# EasyEDA Pro project ProPrj_ExtModule-001_2024-08-27.epro

# Schematic ExtModule-001
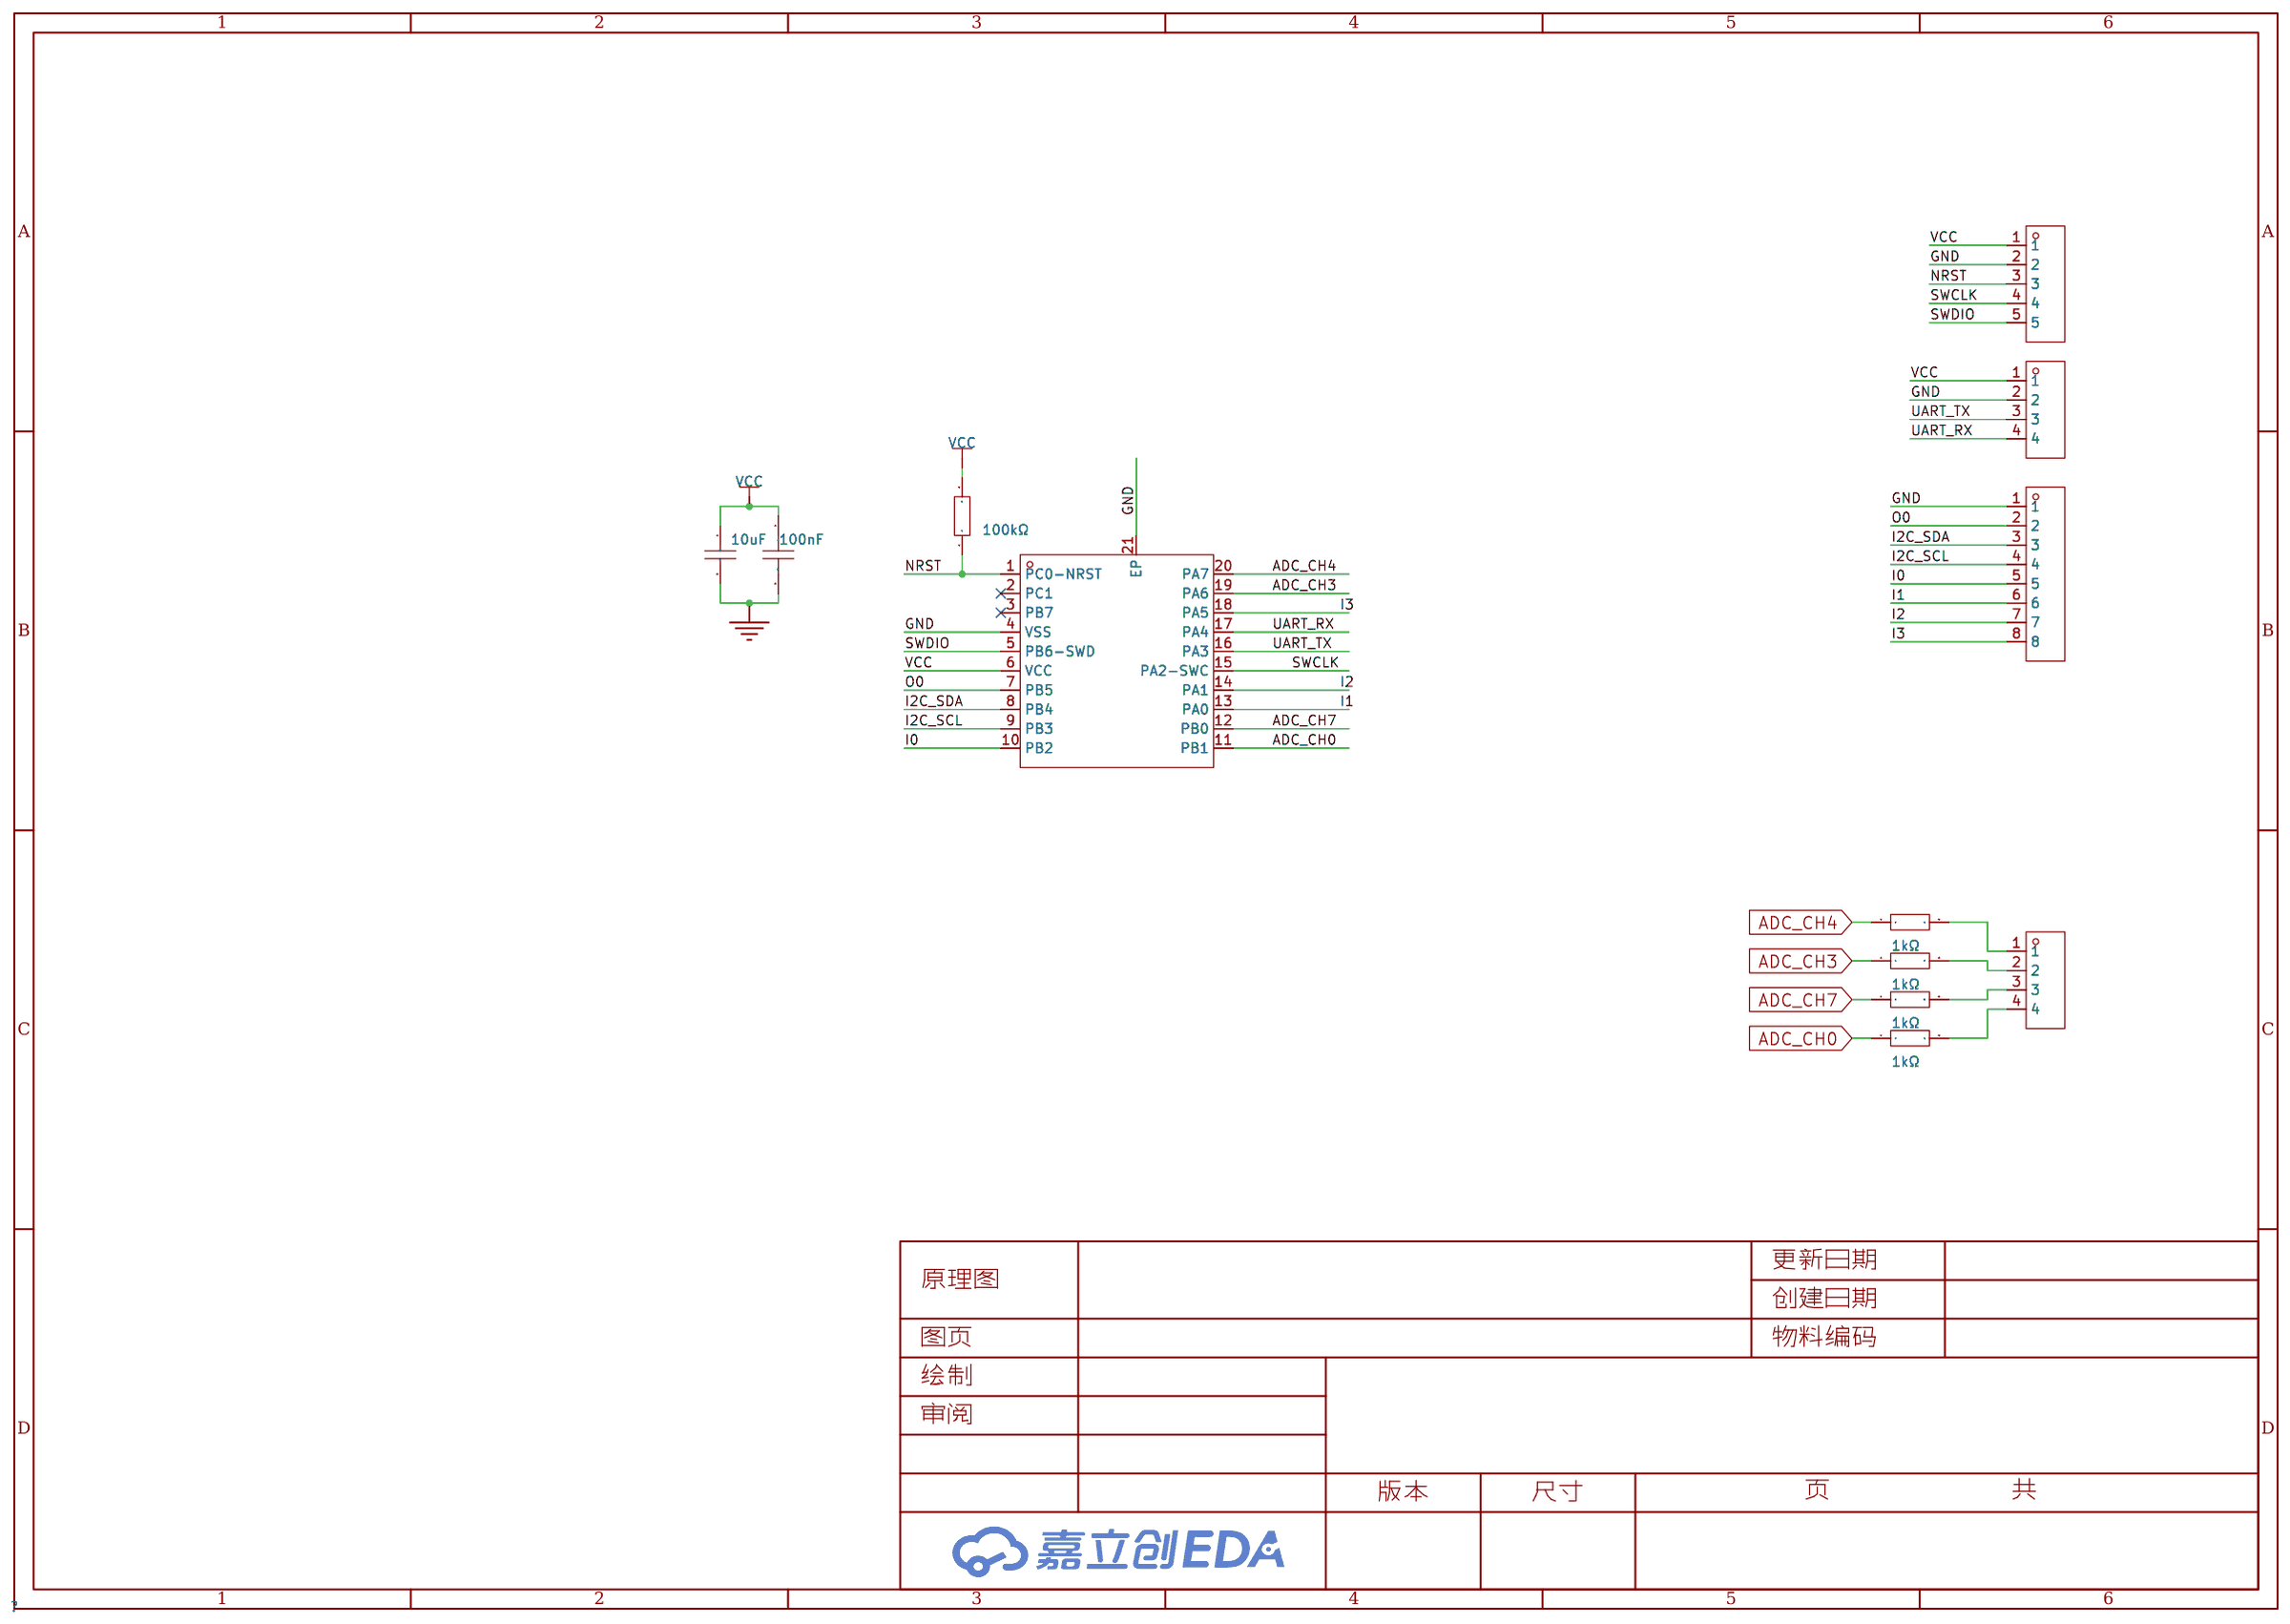
[diagram p0: schematic sheet]

## Parts
C3  100nF  [C0402]
C4  10uF  [C0402]
CN1  HC-PZ254-11.5L-1x5PZ  [HDR-TH_5P-P2.54-V-M]  (no BOM)
H1  PZ254V-11-04P  [HDR-TH_4P-P2.54-V-M]  (no BOM)
H2  PZ254V-11-08P  [HDR-TH_8P-P2.54-V-M]  (no BOM)
H3  PZ254V-11-04P  [HDR-TH_4P-P2.54-V-M]  (no BOM)
R1  100kΩ  [R0402]
R2  1kΩ  [R0402]
R3  1kΩ  [R0402]
R4  1kΩ  [R0402]
R5  1kΩ  [R0402]
U1  2dbf3a06cba34a84b0df513ae8ead8ff  [QFN-20_L3.0-W3.0-P0.40-TL-EP1.7]

## Library data of the parts
C3 = CC0402KRX7R7BB104: 容值:100nF;精度:±10%;额定电压:16V;材质(温度系数):X7R;; LCSC Part Name: 100nF ±10% 16V; Supplier Part: C60474; Manufacturer: YAGEO(国巨); Supplier Footprint: 0402; JLCPCB Part Class: Extended Part; Datasheet: https://atta.szlcsc.com/upload/public/pdf/source/20211223/9278FD768280B81DDBEF48FA36411A03.pdf; Supplier: LCSC; Tolerance: ±10%; Voltage Rated: 16V; Temperature Coefficient: X7R
C4 = CL05A106MQ5NUNC: 容值:10uF;精度:±20%;额定电压:6.3V;材质(温度系数):X5R;; LCSC Part Name: 10uF ±20% 6.3V; Supplier Part: C15525; Manufacturer: SAMSUNG(三星); Supplier Footprint: 0402; JLCPCB Part Class: 基础库; Datasheet: https://atta.szlcsc.com/upload/public/pdf/source/20220823/2B02EE04F8F211D38A52DCB16EB6BEBA.pdf; Supplier: LCSC; Tolerance: ±20%; Voltage Rated: 6.3V; Temperature Coefficient: X5R
CN1 = HC-PZ254-11.5L-1x5PZ: 插针结构：1x5P间距：2.54mm行距：-圆针/方针:方针安装类型:直插排数:单排总PIN位数:5P额定电流:3A额定电压:1000V配合针长度:6mm塑高:2.5mm端接针长度:3mm触头材质:黄铜触头镀层:金工作温度范围:-40℃~+105℃焊接温度(最大值):260℃@5s颜色:黑色; LCSC Part Name: 间距2.54mm 1x5Pin 直插 H2.5 L11.5; Supplier Part: C27985190; Manufacturer: HC(虹成电子); Supplier Footprint: 插件,P=2.54mm; Datasheet: https://atta.szlcsc.com/upload/public/pdf/source/20240710/9646E7AD10E42E713FE23605CE048B80.pdf; Supplier: LCSC
H1 H3 = PZ254V-11-04P: 插针结构:1x4P;间距:2.54mm;行距:-;圆针/方针:方针;安装类型:直插;排数:单排;总PIN位数:4P;额定电流:3A;额定电压:250V;配合针长度:6mm;塑高:2.5mm;端接针长度:3mm;触头材质:-;工作温度范围:-40℃~+105℃;颜色:黑色;; LCSC Part Name: 间距:2.54mm 1x4P 直插 方针; Supplier Part: C2691448; Manufacturer: XFCN(兴飞); Supplier Footprint: 插件,P=2.54mm; JLCPCB Part Class: 扩展库; Datasheet: https://atta.szlcsc.com/upload/public/pdf/source/20200309/C492403_F9F19131791D08044AD4F84F8E751A34.pdf; Supplier: LCSC; Pin Structure: 1x4P; Pitch: 2.54mm; Circluar Pins/Square Pins: 方针; Mounting Type: 直插; Number of Rows: 单排; Number of Pins: 4P; Current Rating (Max): 3A; Voltage Rating (Max): 250V; Length of Mating Pin: 6mm; Insulation Height: 2.5mm; Length of End Connection Pin: 3mm; Operating Temperature Range: -40℃~+105℃; Color: 黑色
H2 = PZ254V-11-08P: 插针结构:1x8P;间距:2.54mm;行距:-;圆针/方针:方针;安装类型:直插;排数:单排;总PIN位数:8P;额定电流:-;额定电压:-;配合针长度:6mm;塑高:2.5mm;端接针长度:3mm;触头材质:黄铜;触头镀层:-;工作温度范围:-40℃~+105℃;颜色:黑色;; LCSC Part Name: 间距:2.54mm 1x8P 直插 方针; Supplier Part: C492407; Manufacturer: XFCN(兴飞); Supplier Footprint: 插件,P=2.54mm; JLCPCB Part Class: 扩展库; Datasheet: https://atta.szlcsc.com/upload/public/pdf/source/20200309/C492407_83A6FB26A2233368EDB9516968EC6149.pdf; Supplier: LCSC; Pin Structure: 1x8P; Pitch: 2.54mm; Circluar Pins/Square Pins: 方针; Mounting Type: 直插; Number of Rows: 单排; Number of Pins: 8P; Length of Mating Pin: 6mm; Insulation Height: 2.5mm; Length of End Connection Pin: 3mm; Contact Material: 黄铜; Operating Temperature Range: -40℃~+105℃; Color: 黑色
R1 = RC0402FR-07100KL: 电阻类型:厚膜电阻;阻值:100kΩ;精度:±1%;功率:62.5mW;最大工作电压:50V;温度系数:±100ppm/℃;; LCSC Part Name: 厚膜电阻 100kΩ ±1% 62.5mW; Supplier Part: C60491; Manufacturer: YAGEO(国巨); Supplier Footprint: 0402; JLCPCB Part Class: 扩展库; Datasheet: https://atta.szlcsc.com/upload/public/pdf/source/20180927/C295883_E8D83085EA81BD7DE0B2B681138C15EE.pdf; Supplier: LCSC; Type: 厚膜电阻; Tolerance: ±1%; Power(Watts): 62.5mW; Overload Voltage (Max): 50V; Temperature Coefficient: ±100ppm/℃; Operating Temperature Range: -55℃~+155℃
R2-R5 = RC0402FR-071KL: 电阻类型:厚膜电阻;阻值:1kΩ;精度:±1%;功率:62.5mW;最大工作电压:50V;温度系数:±100ppm/℃;; LCSC Part Name: 厚膜电阻 1kΩ ±1% 62.5mW; Supplier Part: C106235; Manufacturer: YAGEO(国巨); Supplier Footprint: 0402; JLCPCB Part Class: 扩展库; Datasheet: https://atta.szlcsc.com/upload/public/pdf/source/20180927/C295883_E8D83085EA81BD7DE0B2B681138C15EE.pdf; Supplier: LCSC; Type: 厚膜电阻; Tolerance: ±1%; Power(Watts): 62.5mW; Overload Voltage (Max): 50V; Temperature Coefficient: ±100ppm/℃; Operating Temperature Range: -55℃~+155℃
U1 = PY32F002BF15U6TR: Supplier: LCSC; Supplier Part: C7469099; Manufacturer: PUYA(普冉); JLCPCB Part Class: 扩展库; Supplier Footprint: QFN-20-EP(3x3); Datasheet: https://atta.szlcsc.com/upload/public/pdf/source/20230721/558A839BF110561168DB9B6F0054F7DC.pdf

## Nets
GND: C3.2 C4.2 CN1.2 H1.2 H2.1 U1.4(VSS) U1.21(EP)
VCC: C3.1 C4.1 CN1.1 H1.1 R1.2 U1.6(VCC)
ADC_CH0: R5.1 U1.11(PB1)
ADC_CH3: R3.1 U1.19(PA6)
ADC_CH4: R2.1 U1.20(PA7)
ADC_CH7: R4.1 U1.12(PB0)
I0: H2.5 U1.10(PB2)
I1: H2.6 U1.13(PA0)
I2: H2.7 U1.14(PA1)
I2C_SCL: H2.4 U1.9(PB3)
I2C_SDA: H2.3 U1.8(PB4)
I3: H2.8 U1.18(PA5)
NRST: CN1.3 R1.1 U1.1(PC0-NRST)
O0: H2.2 U1.7(PB5)
SWCLK: CN1.4 U1.15(PA2-SWC)
SWDIO: CN1.5 U1.5(PB6-SWD)
UART_RX: H1.4 U1.17(PA4)
UART_TX: H1.3 U1.16(PA3)
$1N1200: H3.2 R3.2
$1N1206: H3.3 R4.2
$1N1215: H3.4 R5.2
$1N1221: H3.1 R2.2

Not connected (* = marked no-connect by the designer): U1 2(PC1)* 3(PB7)*

# Board ExtModule-001
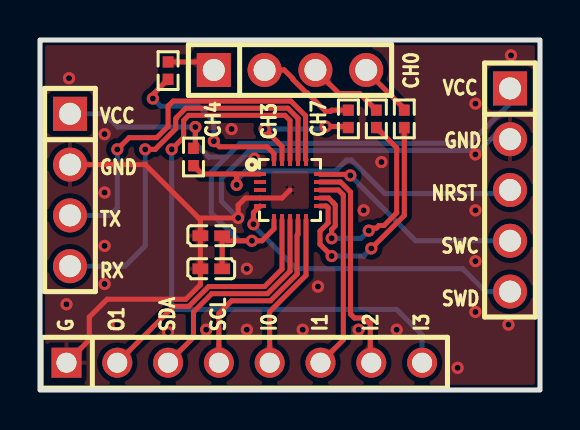
[diagram p1: board, top side]
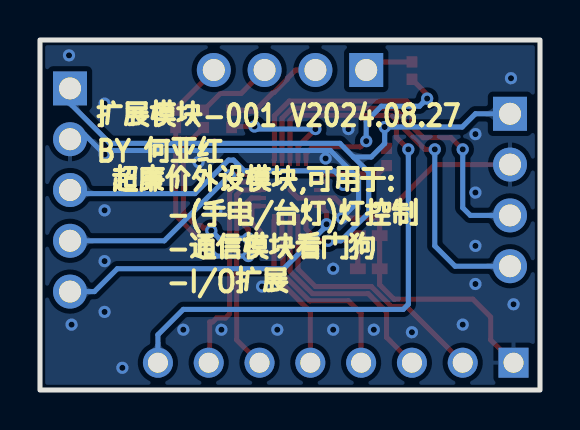
[diagram p2: board, bottom side, seen from below]

Outline 25 x 17.5 mm; copper layers: Top Layer, Bottom Layer. Coordinates in mm from the lower left corner of the outline.
Outline path: rectangle 0,17.5 25,0
Stack: Top Layer 0.035mm / Dielectric1 1.51mm FR4 er 4.5 / Bottom Layer 0.035mm

## Design rules (mm)
template: JLCPCB Capability(Two Layers Board)
spacing copperThickness1oz (default): track to track 0.102, other pairs 0.152 to 0.3
spacing copperThickness2oz: track to track 0.203, other pairs 0.152 to 0.3
track width copperThickness1oz (default): min 0.127, default 0.254, max 2.54
track width copperThickness2oz: min 0.203, default 0.254, max 2.54
differential pair differentialPair (default): width min 0.127, default 0.254, max 2.54; gap min 0.152, default 0.152
via viaSize (default): diameter min 0.5, default 0.61, max 10; hole min 0.3, default 0.305, max 6.3

## Placement (name value [footprint] x y rotation side)
C3  100nF  [C0402]  8.56 7.71 180 top
C4  10uF  [C0402]  8.56 6.06 180 top
CN1  HC-PZ254-11.5L-1x5PZ  [HDR-TH_5P-P2.54-V-M]  23.5 10 270 top
H1  PZ254V-11-04P  [HDR-TH_4P-P2.54-V-M]  1.5 10 270 top
H2  PZ254V-11-08P  [HDR-TH_8P-P2.54-V-M]  10.21 1.36 0 top
H3  PZ254V-11-04P  [HDR-TH_4P-P2.54-V-M]  12.5 16 0 top
R1  100kΩ  [R0402]  7.67 11.65 90 top
R2  1kΩ  [R0402]  6.4 15.97 90 top
R3  1kΩ  [R0402]  15.42 13.56 90 top
R4  1kΩ  [R0402]  16.82 13.56 90 top
R5  1kΩ  [R0402]  18.22 13.56 90 top
U1  2dbf3a06cba34a84b0df513ae8ead8ff  [QFN-20_L3.0-W3.0-P0.40-TL-EP1.7]  12.5 10 0 top

## Footprints (pads in the part's own frame, mm; a bottom-side part is the same pattern mirrored in y, then rotated)
C0402
  rect 0.79x0.54 smd: 1(-0.545,0) 2(0.545,0)
HDR-TH_4P-P2.54-V-M
  rect 1.7x1.7 hole 1.1: 1(-3.81,0)
  round 1.7 hole 1.1: 2(-1.27,0) 3(1.27,0) 4(3.81,0)
HDR-TH_5P-P2.54-V-M
  rect 1.7x1.7 hole 1.1: 1(-5.08,0)
  round 1.7 hole 1.1: 2(-2.54,0) 3(0,0) 4(2.54,0) 5(5.08,0)
HDR-TH_8P-P2.54-V-M
  rect 1.5x1.5 hole 1: 1(-8.89,0)
  round 1.5 hole 1: 2(-6.35,0) 3(-3.81,0) 4(-1.27,0) 5(1.27,0) 6(3.81,0) 7(6.35,0) 8(8.89,0)
QFN-20_L3.0-W3.0-P0.40-TL-EP1.7
  rect 0.6x0.2 smd: 1(-1.5,0.8) 2(-1.5,0.401) 3(-1.5,0) 4(-1.5,-0.4) 5(-1.5,-0.8) 11(1.5,-0.8) 12(1.5,-0.4) 13(1.5,0) 14(1.5,0.401) 15(1.5,0.8)
  rect 0.2x0.6 smd: 6(-0.8,-1.5) 7(-0.4,-1.5) 8(0,-1.5) 9(0.4,-1.5) 10(0.799,-1.5) 16(0.8,1.5) 17(0.4,1.5) 18(0,1.5) 19(-0.4,1.5) 20(-0.8,1.5)
  rect 0.003x0.003 smd: 21(0,0)
R0402
  rect 0.566x0.54 smd: 1(-0.433,0) 2(0.433,0)

## Nets
As in the schematic.

Pads without a net: U1 2 3

## Via types
v1: diameter 0.61, hole 0.305, Top Layer to Bottom Layer, 44 vias

## Routing (per net, layer and track width the routed paths; a pad name or vN(x,y) marks a point on that pad's centre or on a via; arc(x,y) is an arc through that point)
GND: length 43.2
  Top Layer w0.254: 7.93,8.6 8.02,8.51 C3.2 C4.2 8.02,5.26 7.29,4.54 3.36,4.54 2.47,3.65 2.47,2.51 H2.1 ; 7.93,8.6 5.26,11.27 H1.2 ; 7.93,8.6 v1(9.91,8.6) 9.91,9.24 10.27,9.6 U1.4 12.1,9.6 U1.21
  Bottom Layer w0.254: v1(9.91,8.6) 9.07,9.44 9.07,10.56 10.48,11.98 21.97,11.98 22.79,12.79 23.25,12.79 CN1.2
  vias: v1(1.32,4.28) v1(1.45,15.59) v1(3.23,12.79) v1(3.23,9.87) v1(3.23,7.21) v1(3.23,5.3) v1(3.86,3.27) v1(6.4,2.89) v1(8.31,3.02) v1(9.58,13.05) v1(10.34,6.06) v1(10.34,3.02) v1(10.72,11.58) v1(13.13,3.02) v1(13.9,5.17) v1(15.93,3.02) v1(16.18,8.98) v1(17.07,11.4) v1(17.83,3.02) v1(20.88,1.11) v1(21.77,14.32) v1(21.77,11.78) v1(21.77,8.98) v1(21.77,6.44) v1(21.77,3.9) v1(23.42,3.27) v1(23.55,16.73)
VCC: length 37.2
  Top Layer w0.254: v1(7.77,13.15) 7.77,12.08 R1.2 ; U1.6 11.7,8.06 11.1,7.46 v1(10.59,7.46) 9.36,7.46 C3.1 C4.1
  Bottom Layer w0.254: 9.32,11.65 10.01,12.33 21.5,12.33 23.5,14.33 CN1.1 ; 9.32,11.65 8.56,10.89 8.56,8.86 9.96,7.46 v1(10.59,7.46) ; 9.32,11.65 8.44,11.65 7.77,12.32 v1(7.77,13.15) 3.89,13.15 3.23,13.81 H1.1
ADC_CH0: length 12.1
  Top Layer w0.254: v1(16.56,7.08) 18.22,8.73 18.22,13.12 ; v1(14.58,6.7) 14,7.28 14,7.94 14.41,8.35 14.41,9.11 14.32,9.2 U1.11
  Bottom Layer w0.254: v1(14.58,6.7) 16.18,6.7 v1(16.56,7.08)
ADC_CH3: length 6.2
  Top Layer w0.254: v1(14.28,13.17) 15.37,13.17 15.42,13.12 ; U1.19 12.1,12.18 v1(11.23,13.05)
  Bottom Layer w0.254: v1(11.23,13.05) 14.15,13.05 v1(14.28,13.17)
ADC_CH4: length 9.4
  Top Layer w0.254: U1.20 11.7,11.82 11.36,12.16 8.97,12.16 v1(8.69,12.44) ; R2.1 5.64,14.77 v1(5.64,14.57)
  Bottom Layer w0.254: v1(5.64,14.57) 6.02,14.19 7.93,14.19 8.69,13.43 v1(8.69,12.44)
ADC_CH7: length 11.1
  Top Layer w0.254: v1(16.44,7.97) 16.56,8.09 16.82,8.09 16.94,8.22 17.2,8.22 17.83,8.86 17.83,12.11 16.82,13.12 ; v1(14.58,7.59) 14.58,8.02 14.76,8.2 14.76,9.26 14.66,9.36 14.66,9.36 14.42,9.6 U1.12
  Bottom Layer w0.254: v1(14.58,7.59) 16.06,7.59 v1(16.44,7.97)
I0: length 7.9
  Top Layer w0.254: H2.5 11.48,3.92 13.3,5.73 U1.10
I1: length 10.1
  Top Layer w0.254: U1.13 14.92,10 15.17,9.75 15.17,2.51 H2.6
I2: length 11
  Top Layer w0.254: H2.7 16.51,1.42 16.51,3.4 16.37,3.4 16.17,3.6 15.73,3.6 15.52,3.8 15.52,9.9 15.02,10.4 U1.14
I2C_SCL: length 9.9
  Top Layer w0.254: U1.9 12.9,7.78 12.86,7.74 12.86,5.79 11.53,4.46 9.58,4.46 8.94,3.83 H2.4
I2C_SDA: length 11.3
  Top Layer w0.254: H2.3 7.67,2.63 7.67,3.9 8.59,4.82 11.38,4.82 12.5,5.94 U1.8
I3: length 31.5
  Top Layer w0.254: v1(6.58,12.03) 7.18,12.63 7.18,13.48 7.44,13.73 12.25,13.73 12.5,13.48 U1.18
  Bottom Layer w0.254: v1(6.58,12.03) 6.58,4.28 6.84,4.03 17.83,4.03 19.1,2.76 H2.8
NRST: length 19.2
  Top Layer w0.254: U1.1 9.74,10.8 ; 9.74,10.8 8.09,10.8 R1.1 ; 9.74,10.8 9.83,10.7 v1(9.83,10.25)
  Bottom Layer w0.254: CN1.3 23.32,9.82 17.25,9.82 15.58,11.5 15.32,11.5 14.79,10.96 10.29,10.96 9.83,10.5 v1(9.83,10.25)
O0: length 12.6
  Top Layer w0.254: U1.7 12.1,6.04 11.23,5.17 8.43,5.17 7.44,4.18 6.68,4.18 H2.2
SWCLK: length 10.9
  Top Layer w0.254: U1.15 14.02,10.78 15.47,10.78 v1(15.52,10.73)
  Bottom Layer w0.254: v1(15.52,10.73) 18.79,7.46 CN1.4
SWDIO: length 15.3
  Top Layer w0.254: v1(10.67,8.29) 10.67,8.87 U1.5
  Bottom Layer w0.254: v1(10.67,8.29) 10.67,8.21 12.82,6.06 21.14,6.06 22.28,4.92 CN1.5
UART_RX: length 20.1
  Top Layer w0.254: U1.17 12.9,13.58 12.39,14.09 7.29,14.09 6.83,13.63 6.83,13.6 6.78,13.56 6.78,13.06 5.76,12.03 v1(5.26,12.03)
  Bottom Layer w0.254: H1.4 4.25,6.19 5.26,7.21 v1(5.26,12.03)
UART_TX: length 19
  Top Layer w0.254: U1.16 13.28,11.52 13.28,13.71 12.54,14.45 6.66,14.45 6.4,14.19 6.4,13.18 5.84,12.62 4.45,12.62 3.87,12.03 v1(3.86,12.03)
  Bottom Layer w0.254: H1.3 3.48,8.73 3.86,9.11 v1(3.86,12.03)
$1N1200: length 5.1
  Top Layer w0.254: R3.2 14.58,13.99 14.53,13.94 14.28,13.94 13.34,14.87 13.3,14.87 12.64,15.53 12.64,15.57 12.22,16 H3.2
$1N1206: length 3.9
  Top Layer w0.254: H3.3 14.94,14.83 15.98,14.83 R4.2
$1N1215: length 2.8
  Top Layer w0.254: R5.2 18.22,14.06 16.31,15.97 H3.4
$1N1221: length 2.5
  Top Layer w0.254: R2.2 8.29,16.4 H3.1

## Copper pours and planes (outline as drawn; the poured copper is in the pictures)
GND on Top Layer: -0.84,18.64 25.71,18.64 25.71,-1.05 -0.84,-1.05
GND on Bottom Layer: -1.09,18.89 26.34,18.89 26.34,0.22 -1.09,0.22

Small or netless copper shapes (teardrops, artwork), in the pictures only: 43 on Top Layer, 25 on Bottom Layer

## Text on the board
Bottom Silkscreen Layer: 超廉价外设模块,可用于: / -(手电/台灯)灯控制 / -通信模块看门狗 / -I/O扩展 | BY 何亚红 | 扩展模块-001 V2024.08.27
Top Silkscreen Layer: VCC | GND | TX | RX | NRST | SWC | SWD | G | O1 | SDA | CH4 | SCL | CH3 | I0 | CH7 | I1 | I2 | CH0 | I3
